# Altium schematic sheet reset.SchDoc: Copper Suicide - Reset
size Letter; CheckedBy: J. Brinton; CompanyName: Signal Laboratories, Inc.; DrawnBy: J. Brinton; Engineer: J. Brinton; Address1: 3479 Edison Way; Address2: Menlo Park CA 94025; Address3: +1 (877) 778-8435; Address4: siglabs.com; Revision: 3; SheetNumber: 38; SheetTotal: 47
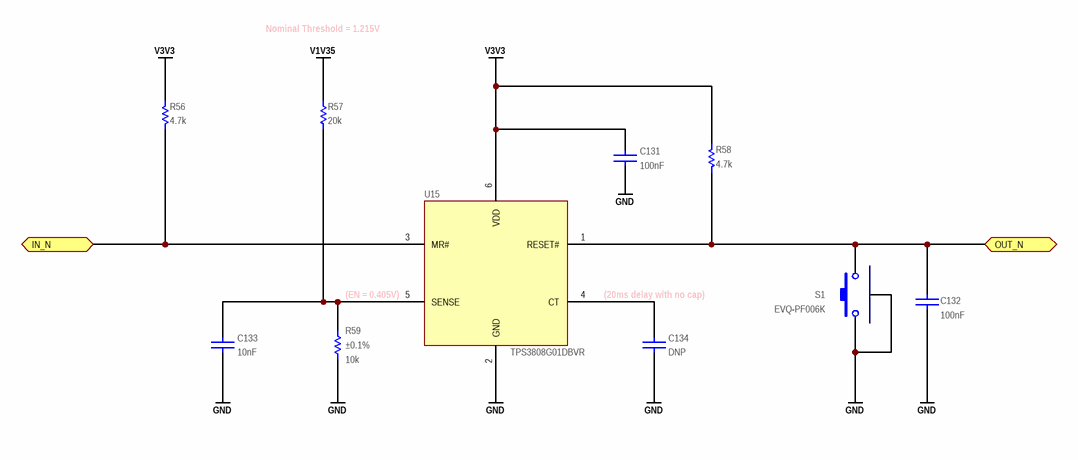
[diagram p0: reset.SchDoc]

## Parts
C131  value 100nF  [CAPC100X50X55L25N]  (hidden comment: GCM155R71H104KE02)
C132  value 100nF  [CAPC100X50X55L25N]  (hidden comment: GCM155R71H104KE02)
C133  value 10nF  [CAPC100X50X55L25N]  (hidden comment: GRM155R71H103KA88)
C134  Do Not Place: DNP  [CAPC200X125X145L45N]  (hidden comment: CAP 0805)
R56  value 4.7k  [RESC1005X40N]  (hidden comment: ERJ-2RKF4701X)
R57  value 20k  [RESC2012X70N]  (hidden comment: ERA-6AEB203V)
R58  value 4.7k  [RESC1005X40N]  (hidden comment: ERJ-2RKF4701X)
R59  value 10k  Tolerance: ±0.1%  [RESC2012X70N]  (hidden comment: ERA-6AEB103V)
S1  EVQ-PF006K  [EVQ-PF006K]
U15  TPS3808G01DBVR  [DBV-6]

## Ports
IN_N (bidir), OUT_N (bidir)

## Nets
GND: C131.2 C132.1 C133.2 C134.2 R59.1 S1.1 S1.3 U15.2(GND)
V1V35: R57.2
V3V3: C131.1 R56.2 R58.2 U15.6(VDD)
IN_N: R56.1 U15.3(MR#) ; port IN_N
OUT_N: C132.2 R58.1 S1.2 U15.1(RESET#) ; port OUT_N
NetC133_1: C133.1 R57.1 R59.2 U15.5(SENSE)
NetC134_1: C134.1 U15.4(CT)

## Notes on the sheet
- Nominal Threshold = 1.215V
- (near U15) (EN = 0.405V)
- (20ms delay with no cap)
- Title
- Engineer
- Revision
- Drawn By
- Checked By
- Date
- Sheet
- of

## Library data of the parts
C131 C132 = CAP: Ceramic Capacitor 100nF ±10% 50V X7R 0402; Manufacturer: Murata; Tr: -55:125; Manufacturer P/N: GCM155R71H104KE02; Tolerance: ±10%; Voltage: 50V; Package: 0402
  C132: Footprint: *
C133 = CAP: Ceramic Capacitor 10nF ±10% 50V X7R 0402; Manufacturer: Murata; Tr: -55:125; Manufacturer P/N: GRM155R71H103KA88; Tolerance: ±10%; Voltage: 50V; Package: 0402
C134 = CAP: Capacitor 0805; Manufacturer: *; Manufacturer P/N: *; Tolerance: *; Voltage: *; Tr: *; Package: 0805
R56 R58 = RES: Thick Film Resistor 4.7k ±1% 0.1W 75V 0402; Manufacturer: Panasonic; Tcr: ±100; Tr: -55:155; Voltage: 75; Power: 0.1; Tolerance: ±1%; Manufacturer P/N: ERJ-2RKF4701X; Alternatives: *; Footprint: *; Package: 0402
R57 = RES: Thin Film Resistor 20k ±0.1% 0.125W 100V 0805; Manufacturer: Panasonic; Tcr: ±25; Tr: -55:155; Voltage: 100; Power: 0.125; Tolerance: ±0.1%; Manufacturer P/N: ERA-6AEB203V; Alternatives: *; Footprint: *; Package: 0805
R59 = RES: Thin Film Resistor 10k ±0.1% 0.125W 100V 0805; Manufacturer: Panasonic; Tcr: ±25; Tr: -55:155; Voltage: 100; Power: 0.125; Manufacturer P/N: ERA-6AEB103V; Package: 0805
S1 = EVQ-PF006K: Tactile Switch; Normally Open; Manufacturer: Panasonic; Manufacturer P/N: EVQ-PF006K
U15 = TPS3808: Low Quiescent Current, Programmable-Delay  Supervisory Circuit; Manufacturer: Texas Instruments; Manufacturer P/N: TPS3808G01DBVR